# EAGLE design BMS Interface (EAGLE 6.5.0)
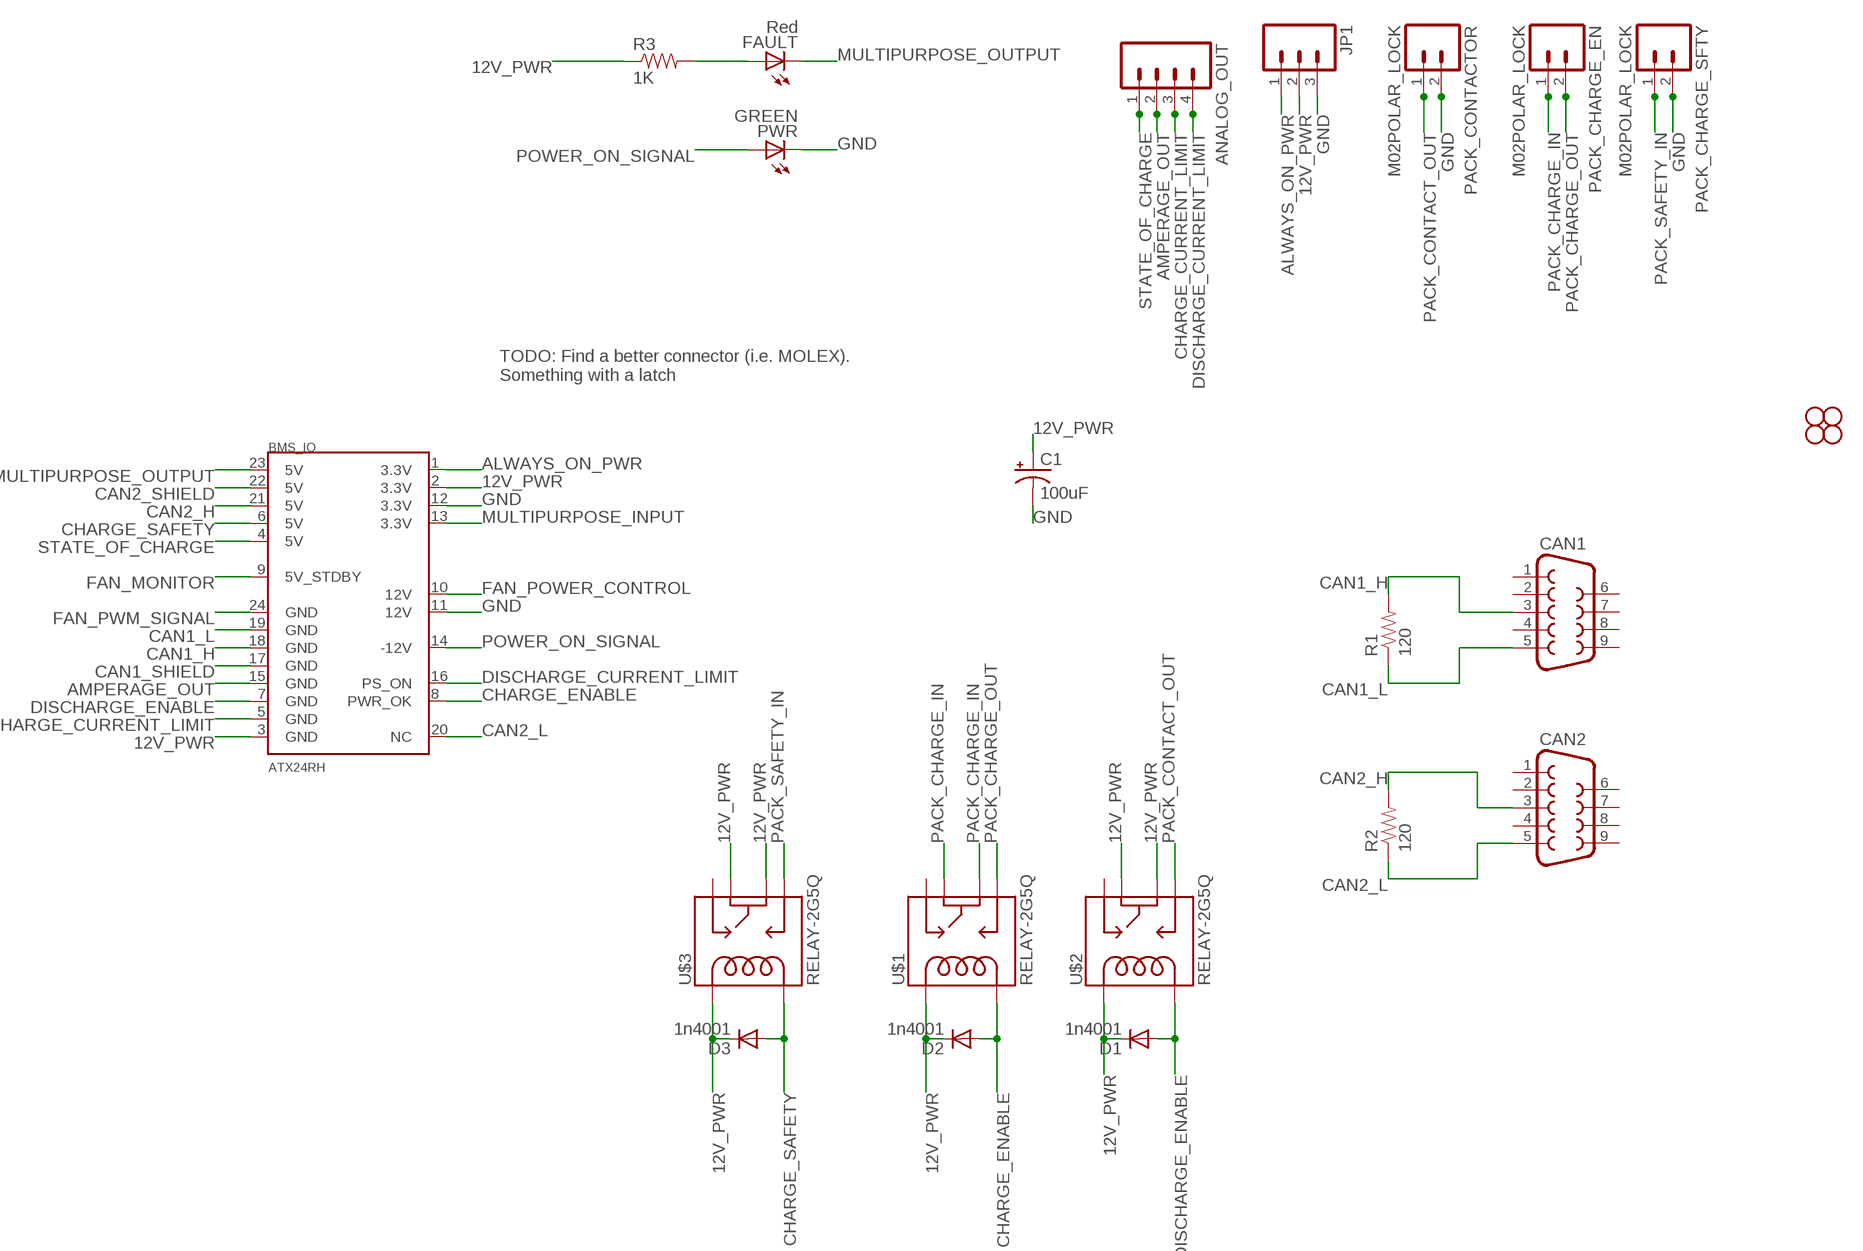
[diagram p0: schematic, sheet 1]

## Parts
ANALOG_OUT  M04POLAR_LOCK  [MOLEX-1X4_LOCK]
BMS_IO  ATX24RH  [ATX24_RIGHT_ANGLE]
C1  100uF  CAP_POLPTH1  [CPOL-RADIAL-100UF-25V]
CAN1  DB9FEMALE  [DB9]
CAN2  DB9FEMALE  [DB9]
D1  1n4001  DIODESMA  [SMA-DIODE]
D2  1n4001  DIODESMA  [SMA-DIODE]
D3  1n4001  DIODESMA  [SMA-DIODE]
FAULT  Red  LED5MM  [LED5MM]
JP1  M03SCREW  [SCREWTERMINAL-3.5MM-3]
PACK_CHARGE_EN  M02POLAR_LOCK  [MOLEX-1X2_LOCK]
PACK_CHARGE_SFTY  M02POLAR_LOCK  [MOLEX-1X2_LOCK]
PACK_CONTACTOR  M02POLAR_LOCK  [MOLEX-1X2_LOCK]
PWR  GREEN  LED5MM  [LED5MM]
R1  120  RESISTOR0603  [0603-RES]
R2  120  RESISTOR0603  [0603-RES]
R3  1K  RESISTOR0805-RES  [0805]
STANDOFF1  STAND-OFF  [STAND-OFF]
STANDOFF2  STAND-OFF  [STAND-OFF]
STANDOFF3  STAND-OFF  [STAND-OFF]
STANDOFF4  STAND-OFF  [STAND-OFF]
U$1  RELAY-2G5Q  [RELAY-G5V]
U$2  RELAY-2G5Q  [RELAY-G5V]
U$3  RELAY-2G5Q  [RELAY-G5V]

## Nets
12V_PWR: BMS_IO.2(3.3V) BMS_IO.3(GND) C1.1(+) D1.C D2.C D3.C JP1.2 R3.1 U$1.2 U$2.2 U$2.5 U$2.6 U$3.2 U$3.5 U$3.6
ALWAYS_ON_PWR: BMS_IO.1(3.3V) JP1.1
AMPERAGE_OUT: ANALOG_OUT.2 BMS_IO.15(GND)
CAN1_H: BMS_IO.18(GND) CAN1.3 R1.2
CAN1_L: BMS_IO.19(GND) CAN1.5 R1.1
CAN1_SHIELD: BMS_IO.17(GND)
CAN2_H: BMS_IO.21(5V) CAN2.3 R2.2
CAN2_L: BMS_IO.20(NC) CAN2.5 R2.1
CAN2_SHIELD: BMS_IO.22(5V)
CHARGE_CURRENT_LIMIT: ANALOG_OUT.3 BMS_IO.5(GND)
CHARGE_ENABLE: BMS_IO.8(PWR_OK) D2.A U$1.9
CHARGE_SAFETY: BMS_IO.6(5V) D3.A U$3.9
DISCHARGE_CURRENT_LIMIT: ANALOG_OUT.4 BMS_IO.16(PS_ON)
DISCHARGE_ENABLE: BMS_IO.7(GND) D1.A U$2.9
FAN_MONITOR: BMS_IO.9(5V_STDBY)
FAN_POWER_CONTROL: BMS_IO.10(12V)
FAN_PWM_SIGNAL: BMS_IO.24(GND)
GND: BMS_IO.11(12V) BMS_IO.12(3.3V) C1.2(-) JP1.3 PACK_CHARGE_SFTY.2 PACK_CONTACTOR.2 PWR.K(C)
MULTIPURPOSE_INPUT: BMS_IO.13(3.3V)
MULTIPURPOSE_OUTPUT: BMS_IO.23(5V) FAULT.K(C)
N$2: FAULT.A R3.2
PACK_CHARGE_IN: PACK_CHARGE_EN.1 U$1.5 U$1.6
PACK_CHARGE_OUT: PACK_CHARGE_EN.2 U$1.10
PACK_CONTACT_OUT: PACK_CONTACTOR.1 U$2.10
PACK_SAFETY_IN: PACK_CHARGE_SFTY.1 U$3.10
POWER_ON_SIGNAL: BMS_IO.14(-12V) PWR.A
STATE_OF_CHARGE: ANALOG_OUT.1 BMS_IO.4(5V)
Unconnected: CAN1.1 CAN1.2 CAN1.4 CAN1.6 CAN1.7 CAN1.8 CAN1.9 CAN2.1 CAN2.2 CAN2.4 CAN2.6 CAN2.7 CAN2.8 CAN2.9 U$1.1 U$2.1 U$3.1

## Notes on the sheet
- TODO: Find a better connector (i.e. MOLEX).
  Something with a latch

## Library data of the parts
ANALOG_OUT = SparkFun-Connectors:M04: Header 4 Standard 4-pin 0.1" header. Use with straight break away headers (SKU : PRT-00116), right angle break away headers (PRT-00553), swiss pins (PRT-00743), machine pins (PRT-00117), and female headers (PRT-00115). Molex polarized connector foot print use with SKU : PRT-08231 with associated crimp pins and housings. 1MM SMD Version SKU: PRT-10208
BMS_IO = SparkFun-Connectors:ATX24: ATX24 Pin Power Supply Connector This is a good connector for connecting a computer power supply to a PCB. It's massive, but provides many amps of power at 5V and 12V. SKU: PRT-09498
C1 = SparkFun-Capacitors:CAP_POL: Capacitor Polarized These are standard SMD and PTH capacitors. Normally 10uF, 47uF, and 100uF in electrolytic and tantalum varieties. Always verify the external diameter of the through hole cap, it varies with capacity, voltage, and manufacturer. The EIA devices should be standard.
CAN1 CAN2 = SparkFun-Connectors:DB9: DB9 Connector Standard DB9 (D-Sub 9) serial connector. Can be used for CAN bus as well as RS485 and RS232. Footprint production proven. Spark Fun Electronics SKU : PRT-00429
D1-D3 = SparkFun-DiscreteSemi:DIODE: Diode These are standard reverse protection diodes and small signal diodes. SMA package can handle up to about 1A. SOD-323 can handle about 200mA. What the SOD-323 package when ordering, there are some mfgs out there that are 5-pin packages.
FAULT PWR = SparkFun-LED:LED: LEDs Standard schematic elements and footprints for 5mm, 3mm, 1206, and 0603 sized LEDs. 5mm - Spark Fun Electronics SKU : COM-00529 (and others)
JP1 = SparkFun-Connectors:M03: Header 3 Standard 3-pin 0.1" header. Use with straight break away headers (SKU : PRT-00116), right angle break away headers (PRT-00553), swiss pins (PRT-00743), machine pins (PRT-00117), and female headers (PRT-00115). Molex polarized connector foot print use with SKU : PRT-08232 with associated crimp pins and housings.
PACK_CHARGE_EN PACK_CHARGE_SFTY PACK_CONTACTOR = SparkFun-Connectors:M02: Standard 2-pin 0.1" header. Use with - straight break away headers ( PRT-00116) - right angle break away headers (PRT-00553) - swiss pins (PRT-00743) - machine pins (PRT-00117) - female headers (PRT-00115) Molex polarized connector foot print use with: PRT-08233 with associated crimp pins and housings. 2.54_SCREWTERM for use with PRT-10571. 3.5mm Screw Terminal footprints for PRT-08084 5mm Screw Terminal footprints for use with PRT-08433
R1 R2 = SparkFun-Resistors:RESISTOR: Resistor Basic schematic elements and footprints for 0603, 1206, and PTH resistors.
R3 = SparkFun-Passives:RESISTOR: Resistor Basic schematic elements and footprints for 0603, 1206, and PTH resistors.
STANDOFF1-STANDOFF4 = SparkFun-Electromechanical:STAND-OFF: #4 Stand Off This is the mechanical footprint for a #4 phillips button head screw. Use the keepout ring to avoid running the screw head into surrounding components. SKU : PRT-00447
U$1-U$3 = SparkFun-Electromechanical:RELAY-2: SPDT relay (COM-00100)

## Board
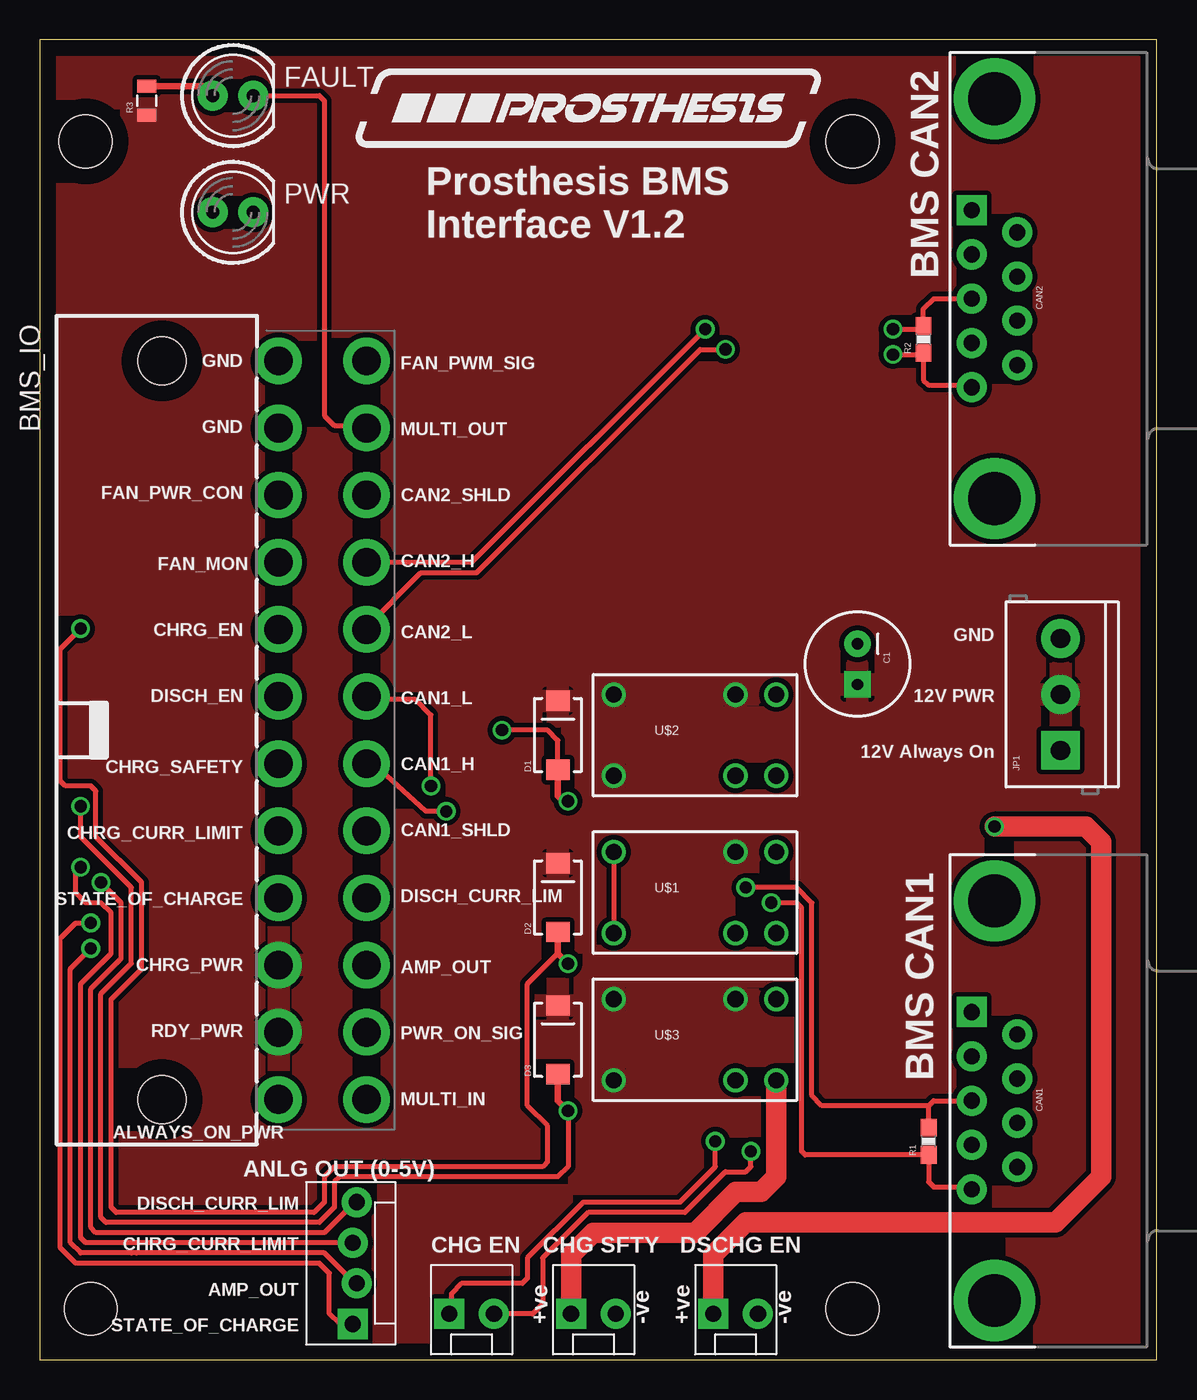
[diagram p1: board, top side]
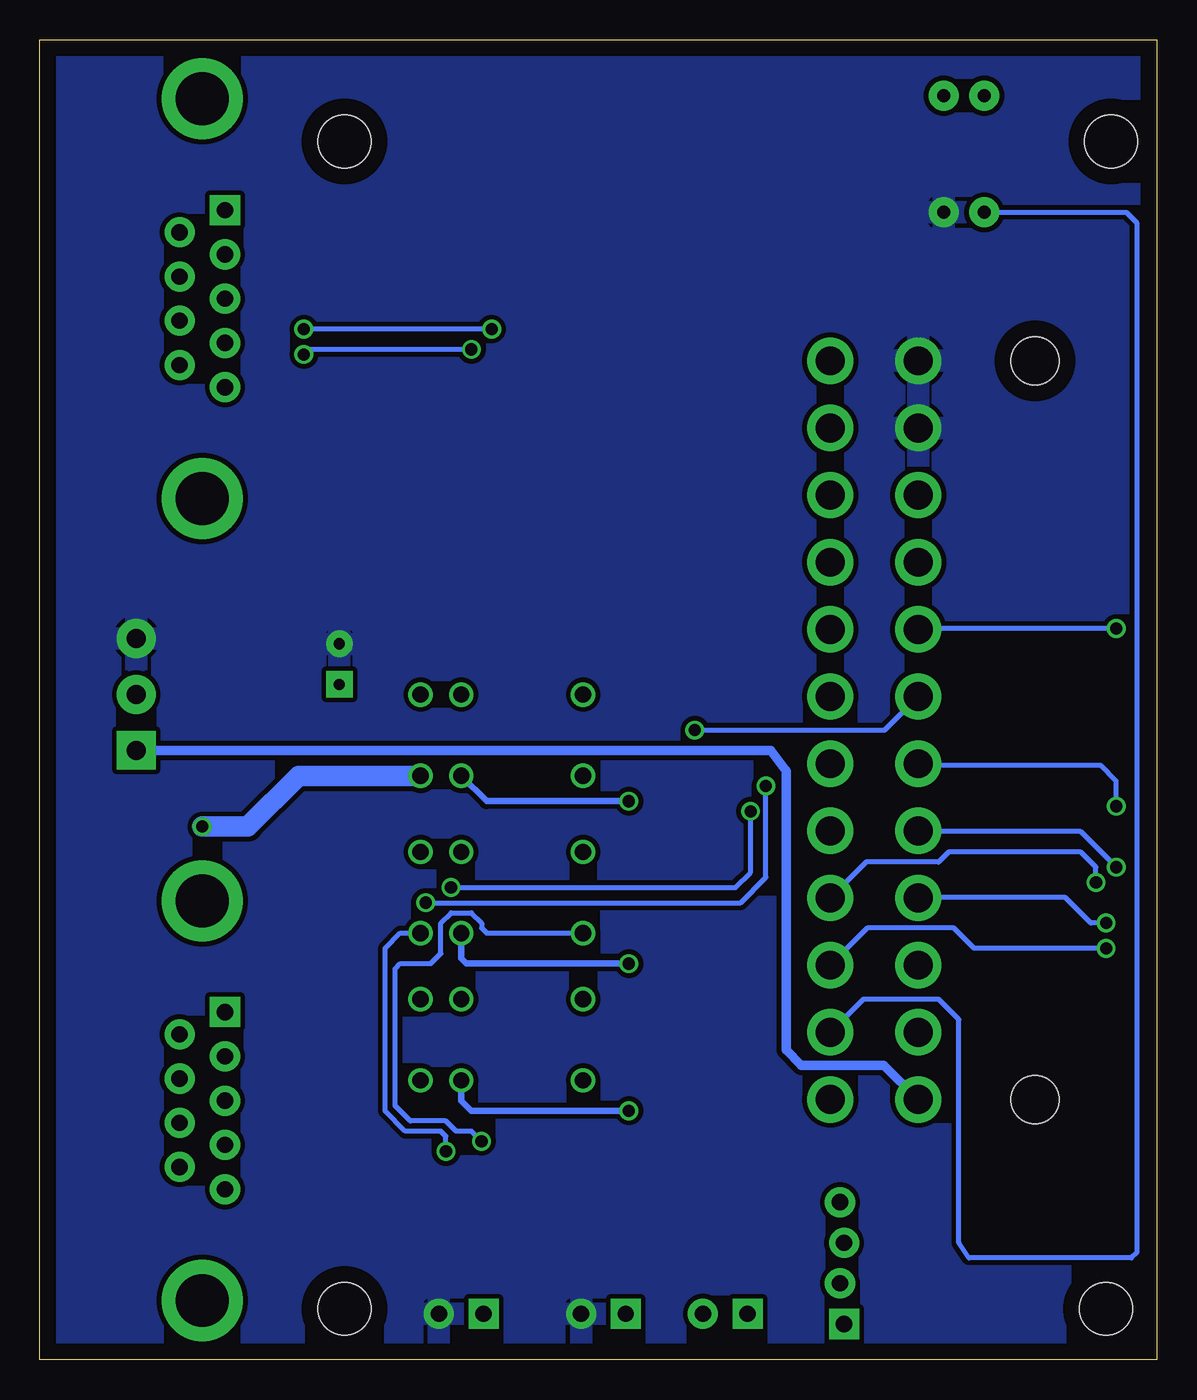
[diagram p2: board, bottom side, seen from below]

Size 69.84 x 82.54 mm. Coordinates in mm from the lower left corner, seen from the top.
Outline: 0,0 69.84,0 69.84,82.54 0,82.54 0,0
Copper layers (1*16): Top 0.035mm / dielectric 1.5mm / Bottom 0.035mm
Design rules "default": minimum track width 10mil, minimum drill 24mil, track to track 8mil, track to pad 8mil, pad to pad 8mil, via to via 8mil, smd to smd 8mil, copper to edge 40mil, drill to drill 8mil, minimum pad ring 10mil, minimum via ring 8mil, stop-mask expansion 4mil, vias tented up to drill 0mil, thermal gap 10mil

### Footprints (pad centres in the part's own frame; a part is rotated, then mirrored left to right if it is on the bottom)
MOLEX-1X4_LOCK = drill 1.016 pad 1.88 square: 1 0,0.127 | drill 1.016 pad 1.88: 2 2.54,-0.127; 3 5.08,0.127; 4 7.62,-0.127
ATX24_RIGHT_ANGLE = drill 1.8 pad 2.9: 1 23.1,4.76; 2 18.9,4.76; 3 14.7,4.76; 4 10.5,4.76; 5 6.3,4.76; 6 2.1,4.76; 7 -2.1,4.76; 8 -6.3,4.76; 9 -10.5,4.76; 10 -14.7,4.76; 11 -18.9,4.76; 12 -23.1,4.76; 13 23.1,10.26; 14 18.9,10.26; 15 14.7,10.26; 16 10.5,10.26; 17 6.3,10.26; 18 2.1,10.26; 19 -2.1,10.26; 20 -6.3,10.26; 21 -10.5,10.26; 22 -14.7,10.26; 23 -18.9,10.26; 24 -23.1,10.26 | hole 3: -23.1,-2.54; 23.1,-2.54
CPOL-RADIAL-100UF-25V = drill 0.7 pad 1.651 square: 1 1.27,0 | drill 0.7 pad 1.651: 2 -1.27,0
DB9 = drill 1.016 pad 1.88 square: 1 -5.54,-1.42 | drill 1.016 pad 1.88: 2 -2.77,-1.42; 3 0,-1.42; 4 2.77,-1.42; 5 5.54,-1.42; 6 -4.15,1.42; 7 -1.38,1.42; 8 1.38,1.42; 9 4.15,1.42 | drill 3.302 pad 5.08: G1 -12.5,0; G2 12.5,0
SMA-DIODE = smd 1.27 x 1.47: A -2.15,0; C 2.15,0
LED5MM = drill 0.813 pad 1.88: A -1.27,0; K 1.27,0
SCREWTERMINAL-3.5MM-3 = drill 1.2 pad 2.413 square: 1 0,0 | drill 1.2 pad 2.413: 2 3.5,0; 3 7,0
MOLEX-1X2_LOCK = drill 1.016 pad 1.88 square: 1 -0.127,0 | drill 1.016 pad 1.88: 2 2.667,0
0603-RES = smd 1.1 x 1: 1 -0.85,0; 2 0.85,0
0805 = smd 0.8 x 1.2: 1 -0.9,0; 2 0.9,0
STAND-OFF = hole 3.302: 0,0
RELAY-G5V = drill 1.016: 1 5.08,2.54; 2 2.54,2.54; 5 -5.08,2.54; 6 -5.08,-2.54; 9 2.54,-2.54; 10 5.08,-2.54

### Placement (x,y rotation side)
ANALOG_OUT  19.68,2.22 90 top
BMS_IO  10.16,39.37 270 top
C1  51.12,43.5 270 top
CAN1  59.69,16.19 270 top
CAN2  59.69,66.36 270 top
D1  32.38,39.05 90 top
D2  32.38,28.89 90 top
D3  32.38,20 90 top
FAULT  12.06,79.06 0 top
JP1  63.82,38.1 90 top
PACK_CHARGE_EN  25.72,2.86 0 top
PACK_CHARGE_SFTY  33.34,2.86 0 top
PACK_CONTACTOR  42.23,2.86 0 top
PWR  12.06,71.75 0 top
R1  55.56,13.65 90 top
R2  55.24,63.82 90 top
R3  6.67,78.74 90 top
STANDOFF1  3.17,3.17 0 top
STANDOFF2  2.86,76.2 0 top
STANDOFF3  50.8,3.17 0 top
STANDOFF4  50.8,76.2 0 top
U$1  40.96,29.21 0 top
U$2  40.96,39.05 0 top
U$3  40.96,20 0 top
U$4  [PROS_LOGO]  18.1,74.3 0 top

### Tracks (layer width: path | path; a pad name or v marks a point on that pad's centre or on a via)
12V_PWR
  pour Top (isolate 0.305): 0.64,81.92 69.22,81.92 69.22,0.64 0.64,0.64
ALWAYS_ON_PWR
  Bottom 0.61: JP1.1 24.13,38.1 23.18,36.83 23.18,19.37 22.23,18.41 17.07,18.41 BMS_IO.1
AMPERAGE_OUT  (via drill 0.76)
  Top 0.305: v3.17,25.72 1.91,24.45 1.91,7.3 2.54,6.67 5.71,6.67 6.03,6.67 17.78,6.67 19.68,4.76 ANALOG_OUT.2
  Bottom 0.305: v3.17,25.72 11.43,25.72 12.7,26.99 18.1,26.99 BMS_IO.15
CAN1_H  (via drill 0.76)
  Top 0.305: R1.2 55.56,15.88 | 55.56,15.88 55.88,16.19 CAN1.3 | 55.56,15.88 48.9,15.88 48.26,16.51 48.26,28.57 47.31,29.53 v44.13,29.53 | v25.4,34.29 24.13,34.29 20.95,37.15 20.54,37.15 BMS_IO.18
  Bottom 0.305: v44.13,29.53 26.35,29.53 25.4,30.48 v25.4,34.29
CAN1_L  (via drill 0.76)
  Top 0.305: CAN1.5 58.13,10.79 55.88,10.79 55.56,11.11 R1.1 47.84,12.8 47.62,13.02 47.62,28.26 47.31,28.57 v45.72,28.57 | v24.45,35.88 24.45,40.32 23.5,41.27 20.61,41.27 BMS_IO.19
  Bottom 0.305: v45.72,28.57 26.04,28.57 24.45,30.16 v24.45,35.88
CAN2_H  (via drill 0.76)
  Top 0.305: CAN2.3 55.88,66.36 55.24,65.72 R2.2 55.03,64.45 v53.34,64.45 | BMS_IO.21 27.01,49.87 v41.59,64.45
  Bottom 0.305: v41.59,64.45 v53.34,64.45
CAN2_L  (via drill 0.76)
  Top 0.305: CAN2.5 58.13,60.96 55.56,60.96 55.24,61.28 R2.1 55.14,62.87 v53.34,62.87 | BMS_IO.20 20.42,45.82 23.81,49.21 27.3,49.21 41.27,63.18 v42.86,63.18
  Bottom 0.305: v42.86,63.18 53.02,63.18 v53.34,62.87
CHARGE_CURRENT_LIMIT  (via drill 0.76)
  Top 0.305: ANALOG_OUT.3 2.86,7.3 2.54,7.62 2.54,23.5 4.45,25.4 4.45,27.94 3.81,28.57 2.86,28.57 2.22,29.21 2.22,30.48 v2.54,30.8
  Bottom 0.305: v2.54,30.8 4.76,33.02 14.87,33.02 BMS_IO.5
CHARGE_ENABLE  (via drill 0.76)
  Top 0.305: v2.54,45.72 1.27,44.45 1.27,36.2 1.59,35.88 3.17,35.88 3.49,35.56 3.49,32.7 6.35,29.84 6.35,24.45 4.45,22.54 4.45,9.53 4.76,9.21 17.14,9.21 17.78,9.84 17.78,11.43 18.41,12.06 31.43,12.06 31.75,12.38 31.75,14.61 30.48,15.88 30.48,23.5 32.38,25.4
  Top 0.406: D2.A 32.38,25.4 v33.02,24.77
  Bottom 0.305: v2.54,45.72 14.87,45.72 BMS_IO.8
  Bottom 0.406: v33.02,24.77 43.18,24.77 43.5,25.08 U$1.9
CHARGE_SAFETY  (via drill 0.76)
  Top 0.305: v33.02,15.56 33.02,12.06 32.38,11.43 18.73,11.43 18.41,11.11 18.41,9.53 17.46,8.57 4.13,8.57 3.81,8.89 3.81,22.86 5.71,24.77 5.71,29.53 2.54,32.7 v2.54,34.61
  Top 0.406: D3.A 32.38,16.19 v33.02,15.56
  Bottom 0.305: v2.54,34.61 2.54,36.2 3.49,37.15 14.48,37.15 BMS_IO.6
  Bottom 0.406: v33.02,15.56 42.86,15.56 43.5,16.19 U$3.9
DISCHARGE_CURRENT_LIMIT  (via drill 0.76)
  Top 0.305: ANALOG_OUT.4 19.68,9.84 17.78,7.94 3.49,7.94 3.17,8.26 3.17,23.18 5.08,25.08 5.08,28.57 v3.81,29.84
  Bottom 0.305: v3.81,29.84 3.81,30.8 4.76,31.75 13.02,31.75 13.65,31.11 18.18,31.11 BMS_IO.16
DISCHARGE_ENABLE  (via drill 0.76)
  Top 0.305: D1.A 32.38,38.73 31.75,39.37 v28.89,39.37
  Top 0.406: D1.A 32.38,35.24 32.7,34.92 v33.02,34.92
  Bottom 0.305: v28.89,39.37 17.02,39.37 BMS_IO.7
  Bottom 0.406: v33.02,34.92 41.91,34.92 U$2.9
GND
  pour Bottom (isolate 0.305): 0.64,81.92 0.64,0.64 69.22,0.64 69.22,81.92
MULTIPURPOSE_OUTPUT
  Top 0.305: FAULT.K 17.46,79.06 17.78,78.74 17.78,59.05 18.41,58.42 20.27,58.42 BMS_IO.23
N$2
  Top 0.305: 10.26,79.59 FAULT.A
  Top 0.406: R3.2 10.21,79.64 FAULT.A
PACK_CHARGE_IN  (via drill 0.76)
  Top 0.305: v42.23,13.65 42.23,12.06 40.01,9.84 33.97,9.84 30.48,6.35 30.48,5.08 30.16,4.76 26.35,4.76 25.72,4.13 25.72,2.98 PACK_CHARGE_EN.1 | U$1.5 U$1.6
  Bottom 0.305: v42.23,13.65 42.86,14.29 43.81,14.29 44.45,14.92 46.67,14.92 47.62,15.88 47.62,24.45 47.31,24.77 45.4,24.77 44.77,25.4 44.77,27.3 44.13,27.94 42.86,27.94 42.23,27.3 42.23,26.99 41.91,26.67 U$1.6
PACK_CHARGE_OUT  (via drill 0.76)
  Top 0.305: v44.45,13.02 44.45,12.06 44.13,11.75 42.86,11.75 40.32,9.21 34.29,9.21 31.43,6.35 31.43,3.49 30.8,2.86 PACK_CHARGE_EN.2
  Bottom 0.305: v44.45,13.02 44.45,13.97 44.77,14.29 46.99,14.29 48.26,15.56 48.26,25.72 47.31,26.67 U$1.10
PACK_CONTACT_OUT  (via drill 0.76)
  Top 1.27: PACK_CONTACTOR.1 42.1,6.54 44.13,8.57 63.5,8.57 66.36,11.43 66.36,32.38 65.41,33.34 v59.69,33.34
  Bottom 1.27: v59.69,33.34 56.83,33.34 53.66,36.51 U$2.10
PACK_SAFETY_IN
  Top 1.27: PACK_CHARGE_SFTY.1 33.21,6.54 34.61,7.94 40.96,7.94 43.5,10.48 45.09,10.48 46.04,11.43 U$3.10
POWER_ON_SIGNAL
  Bottom 0.305: PWR.A 1.91,71.75 1.27,71.12 1.27,6.67 1.59,6.35 11.75,6.35 12.38,7.3 12.38,21.27 13.65,22.54 18.35,22.54 BMS_IO.14
STATE_OF_CHARGE  (via drill 0.76)
  Top 0.305: v3.17,27.3 2.22,27.3 1.27,26.35 1.27,6.99 2.22,6.03 17.46,6.03 18.1,5.4 18.1,2.86 18.73,2.22 ANALOG_OUT.1
  Bottom 0.305: v3.17,27.3 4.13,27.3 5.71,28.89 14.9,28.89 BMS_IO.4

### Text on the board
tPlace: BMS CAN2 | GND | FAN_PWM_SIG | GND | MULTI_OUT | FAN_PWR_CON | CAN2_SHLD | FAN_MON | CAN2_H | CHRG_EN | GND | CAN2_L | DISCH_EN | 12V PWR | CAN1_L | 12V Always On | CHRG_SAFETY | CAN1_H | CHRG_CURR_LIMIT | CAN1_SHLD | STATE_OF_CHARGE | DISCH_CURR_LIM | CHRG_PWR | AMP_OUT | RDY_PWR | PWR_ON_SIG | BMS CAN1 | MULTI_IN | ALWAYS_ON_PWR | DISCH_CURR_LIM | CHRG_CURR_LIMIT | CHG EN | CHG SFTY | DSCHG EN | AMP_OUT | STATE_OF_CHARGE | +ve | -ve | +ve | -ve
tNames: Prosthesis BMS / Interface V1.2 | ANLG OUT (0-5V)